# Altium project Programmable Power Supply.PrjPcb (part 2 of 2)
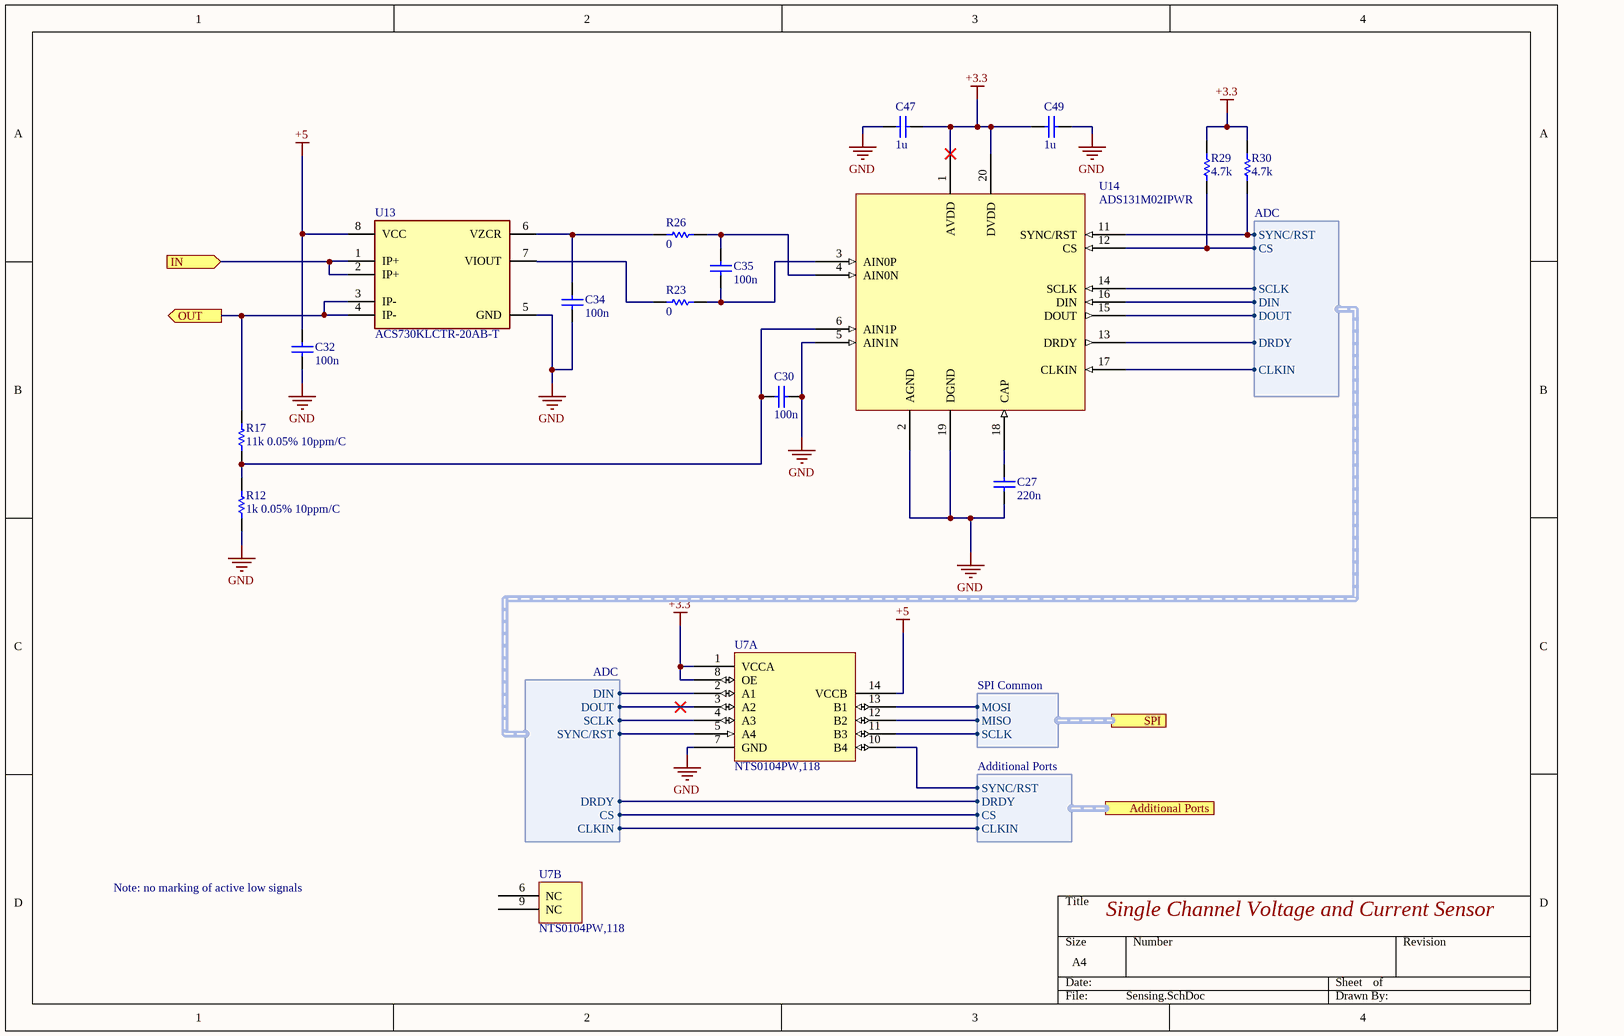
[diagram p5: Sensing.SchDoc]

## Nets that join several sheets
+3.3: MCU & Power (C14.2 U2.1 U2.8 U4.5), U_Sensing (8 pins), U_Sensing (8 pins)
+5: Main (C3.2 C4.2 F1.2), MCU & Power (17 pins), U_SMPS (R16_U_SMPS#1.2), U_LDO (5 pins), U_Sensing (C32_U_Sensing#1.1 U7_U_Sensing#1.14 U13_U_Sensing#1.8), U_SMPS (R16_U_SMPS#2.2), U_LDO (5 pins), U_Sensing (C32_U_Sensing#2.1 U7_U_Sensing#2.14 U13_U_Sensing#2.8)
-5: MCU & Power (C13.2 U3.1), U_SMPS (C28_U_SMPS#1.1 R13_U_SMPS#1.1), U_LDO (C58_U_LDO#1.2 U11_U_LDO#1.4 U12_U_LDO#1.4), U_SMPS (C28_U_SMPS#2.1 R13_U_SMPS#2.1), U_LDO (C58_U_LDO#2.2 U11_U_LDO#2.4 U12_U_LDO#2.4)
GND: Main (13 pins), MCU & Power (18 pins), U_SMPS (16 pins), U_LDO (21 pins), U_Sensing (12 pins), U_SMPS (16 pins), U_LDO (21 pins), U_Sensing (12 pins)
UGnd: Main (FB1.2 J2.4), MCU & Power (U1.5)
VCC: Main (C1.1 C6.1 C11.1 J1.1), U_SMPS (5 pins), U_LDO (C59_U_LDO#1.1 U11_U_LDO#1.7 U12_U_LDO#1.7), U_SMPS (5 pins), U_LDO (C59_U_LDO#2.1 U11_U_LDO#2.7 U12_U_LDO#2.7)
MISO_1: MCU & Power (P1.1 U1.11), U_SMPS (U9_U_SMPS#1.8), U_Sensing (U7_U_Sensing#1.12), U_SMPS (U9_U_SMPS#2.8), U_Sensing (U7_U_Sensing#2.12)
MOSI_1: MCU & Power (P1.4 U1.10), U_SMPS (U9_U_SMPS#1.7), U_LDO (U10_U_LDO#1.3), U_Sensing (U7_U_Sensing#1.13), U_SMPS (U9_U_SMPS#2.7), U_LDO (U10_U_LDO#2.3), U_Sensing (U7_U_Sensing#2.13)
NetC36_U_SMPS#1_2: U_SMPS (5 pins), U_LDO (U16_U_LDO#1.3)
NetC36_U_SMPS#2_2: U_SMPS (5 pins), U_LDO (U16_U_LDO#2.3)
NetC53_U_LDO#1_2: U_LDO (5 pins), U_Sensing (U13_U_Sensing#1.1 U13_U_Sensing#1.2)
NetC53_U_LDO#2_2: U_LDO (5 pins), U_Sensing (U13_U_Sensing#2.1 U13_U_Sensing#2.2)
NetJ3_1: Main (J3.1), U_Sensing (R17_U_Sensing#2.2 U13_U_Sensing#2.3 U13_U_Sensing#2.4)
NetJ4_1: Main (J4.1), U_Sensing (R17_U_Sensing#1.2 U13_U_Sensing#1.3 U13_U_Sensing#1.4)
NetR2_1: Main (R2.1), MCU & Power (U1.3)
NetR4_1: Main (R4.1), MCU & Power (U1.4)
NetR16_U_SMPS#1_1: MCU & Power (U1.21), U_SMPS (R16_U_SMPS#1.1 U9_U_SMPS#1.5)
NetR16_U_SMPS#2_1: MCU & Power (U1.29), U_SMPS (R16_U_SMPS#2.1 U9_U_SMPS#2.5)
NetR21_U_SMPS#1_2: MCU & Power (U1.20), U_SMPS (R21_U_SMPS#1.2 U8_U_SMPS#1.3)
NetR21_U_SMPS#2_2: MCU & Power (U1.28), U_SMPS (R21_U_SMPS#2.2 U8_U_SMPS#2.3)
NetR24_U_LDO#1_1: MCU & Power (U1.25), U_LDO (R24_U_LDO#1.1 U10_U_LDO#1.4)
NetR24_U_LDO#2_1: MCU & Power (U1.30), U_LDO (R24_U_LDO#2.1 U10_U_LDO#2.4)
NetR29_U_Sensing#1_1: MCU & Power (U2.3), U_Sensing (R29_U_Sensing#1.1 U14_U_Sensing#1.12)
NetR29_U_Sensing#2_1: MCU & Power (U2.4), U_Sensing (R29_U_Sensing#2.1 U14_U_Sensing#2.12)
NetU1_26: MCU & Power (U1.26), U_Sensing (U7_U_Sensing#1.10)
NetU1_27: MCU & Power (U1.27), U_Sensing (U14_U_Sensing#1.13)
NetU1_31: MCU & Power (U1.31), U_Sensing (U7_U_Sensing#2.10)
NetU1_32: MCU & Power (U1.32), U_Sensing (U14_U_Sensing#2.13)
NetU2_2: MCU & Power (U2.2), U_Sensing (U14_U_Sensing#1.17), U_Sensing (U14_U_Sensing#2.17)
SCLK_1: MCU & Power (P1.3 U1.9), U_SMPS (U9_U_SMPS#1.6), U_LDO (U10_U_LDO#1.2), U_Sensing (U7_U_Sensing#1.11), U_SMPS (U9_U_SMPS#2.6), U_LDO (U10_U_LDO#2.2), U_Sensing (U7_U_Sensing#2.11)